# EAGLE design preliminary (EAGLE 8.6.0)
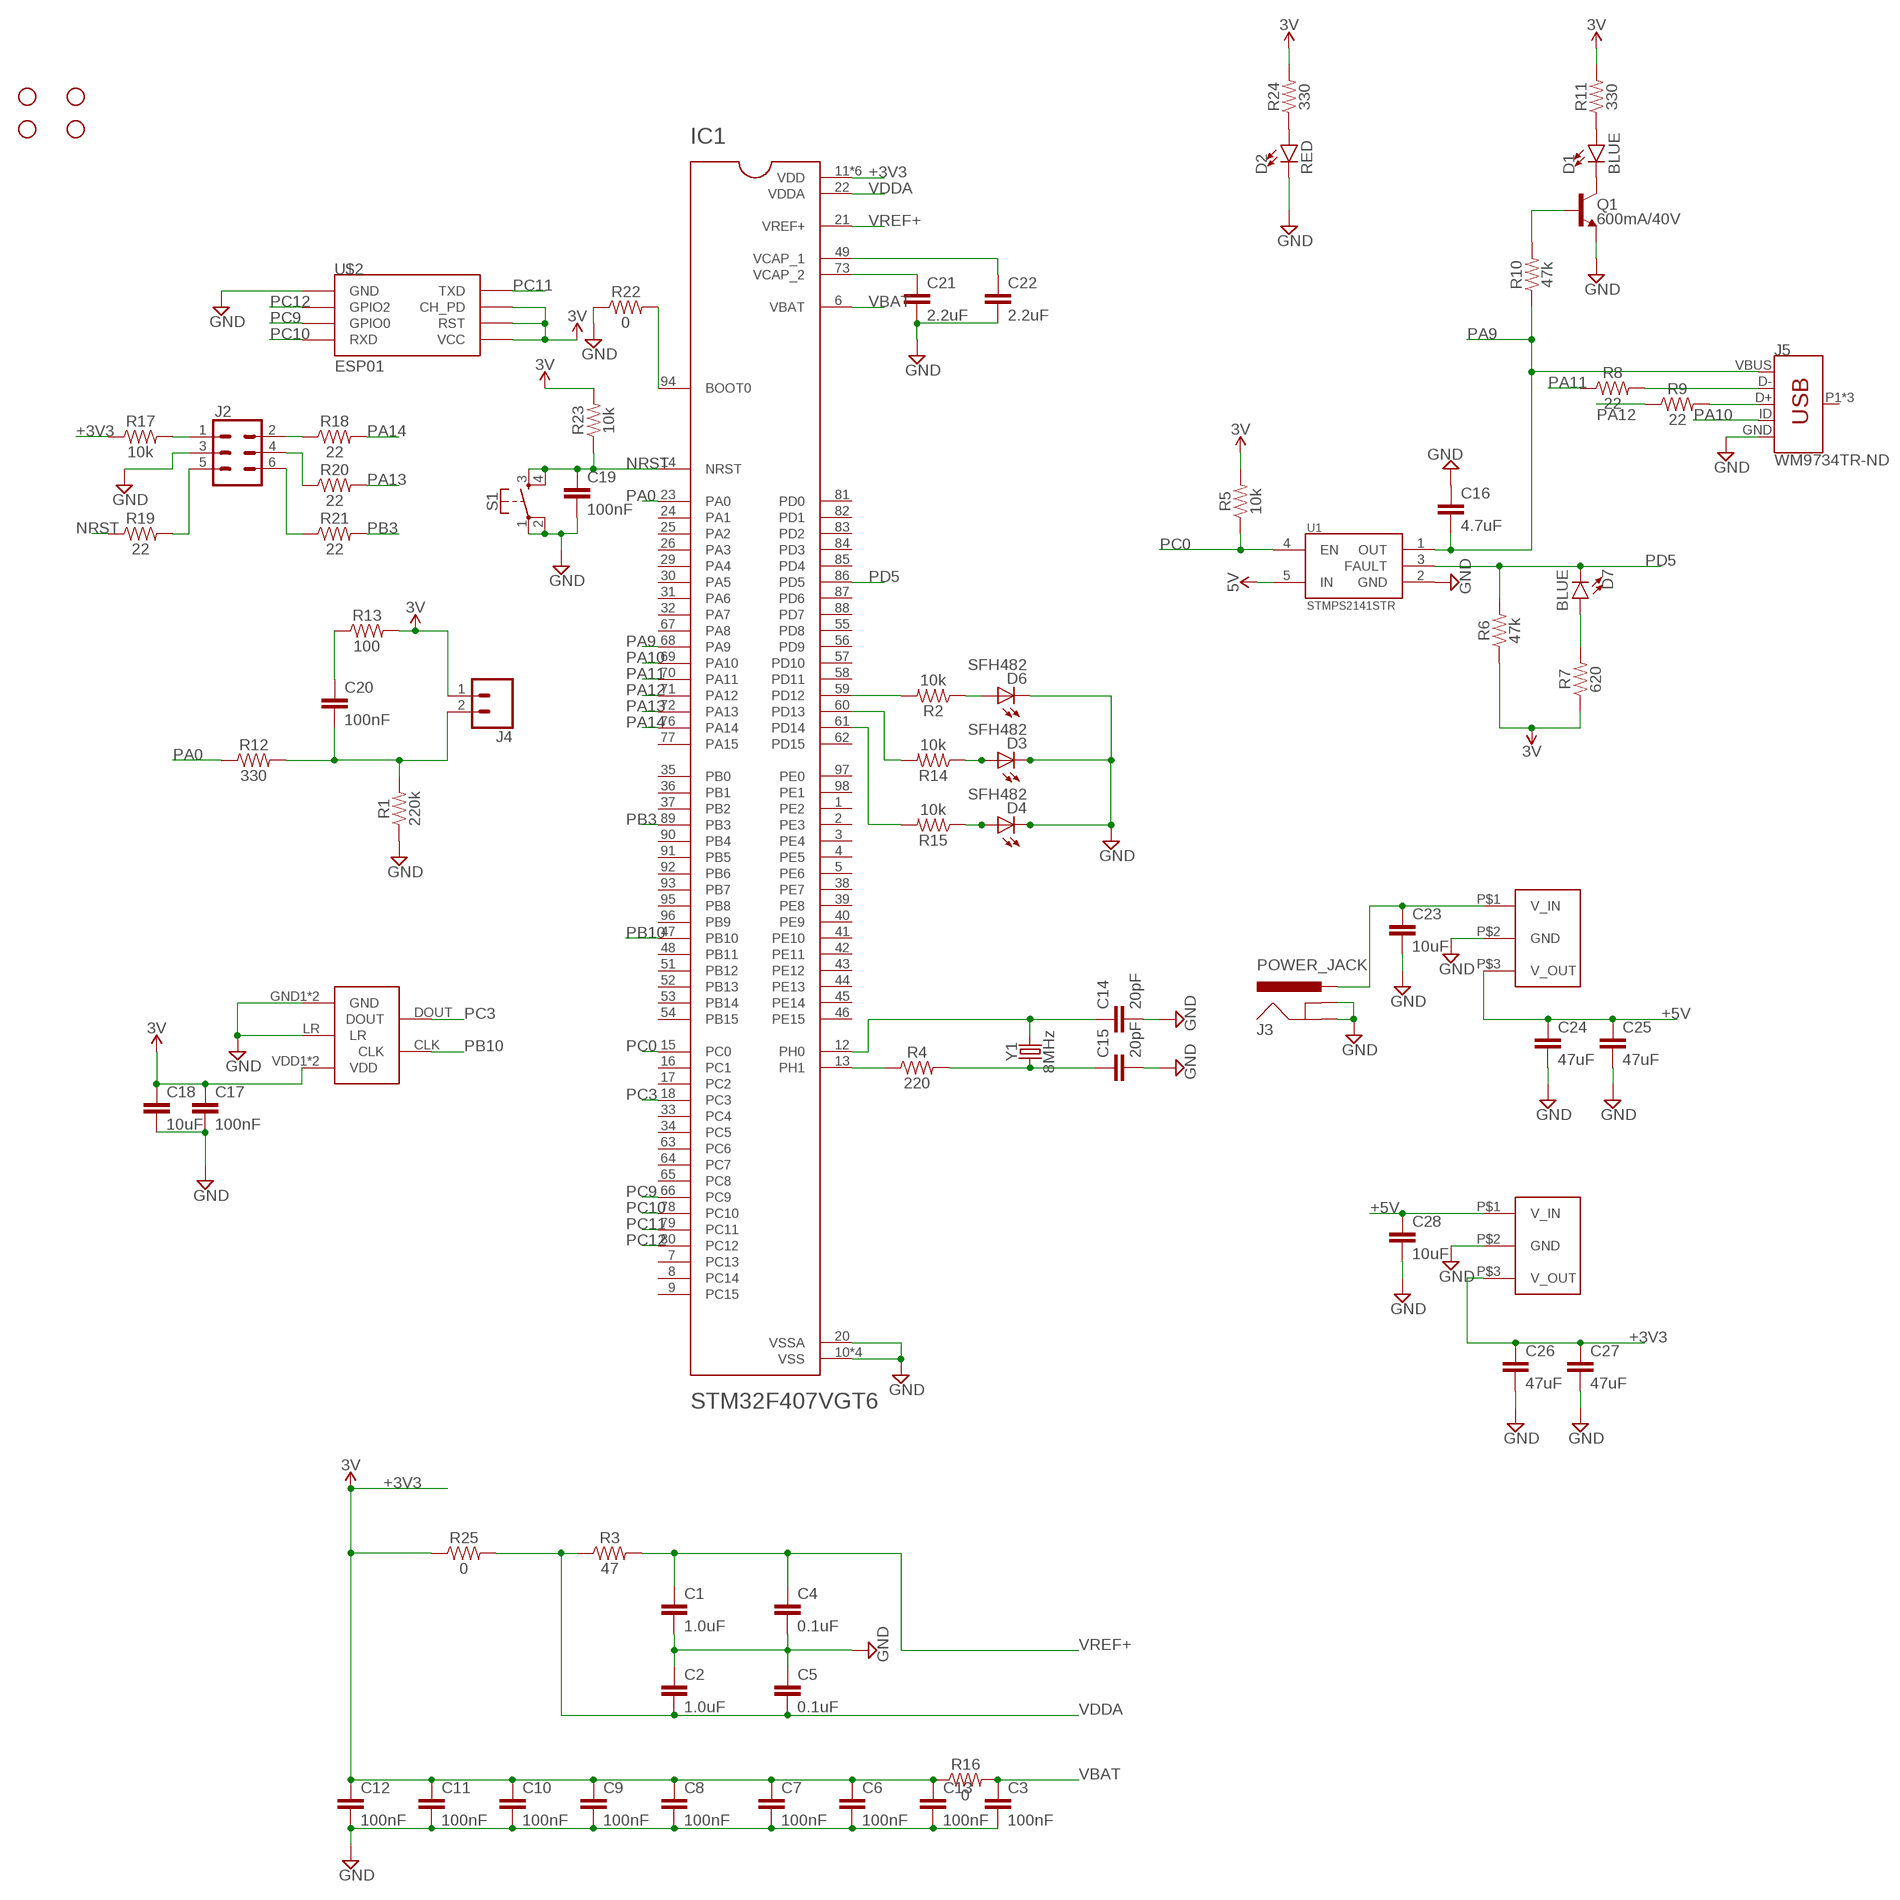
[diagram p0: schematic, sheet 1]

## Parts
C1  1.0uF  1.0UF-0603-16V-10%  [0603]
C2  1.0uF  1.0UF-0603-16V-10%  [0603]
C3  100nF  10NF-0603-50V-10%  [0603]
C4  0.1uF  0.1UF-0603-25V-(+80/-20%)  [0603]
C5  0.1uF  0.1UF-0603-25V-(+80/-20%)  [0603]
C6  100nF  10NF-0603-50V-10%  [0603]
C7  100nF  10NF-0603-50V-10%  [0603]
C8  100nF  10NF-0603-50V-10%  [0603]
C9  100nF  10NF-0603-50V-10%  [0603]
C10  100nF  10NF-0603-50V-10%  [0603]
C11  100nF  10NF-0603-50V-10%  [0603]
C12  100nF  10NF-0603-50V-10%  [0603]
C13  100nF  10NF-0603-50V-10%  [0603]
C14  20pF  22PF-0603-50V-5%  [0603]
C15  20pF  22PF-0603-50V-5%  [0603]
C16  4.7uF  4.7UF0603  [0603]
C17  100nF  10UF-0603-6.3V-20%  [0603]
C18  10uF  10UF-0603-6.3V-20%  [0603]
C19  100nF  3.0NF-0603-50V-5%  [0603]
C20  100nF  3.0NF-0603-50V-5%  [0603]
C21  2.2uF  4.7UF0603  [0603]
C22  2.2uF  4.7UF0603  [0603]
C23  10uF  10UF-0603-6.3V-20%  [0603]
C24  47uF  0.1UF-0603-25V-5%  [0603]
C25  47uF  0.1UF-0603-25V-5%  [0603]
C26  47uF  0.1UF-0603-25V-5%  [0603]
C27  47uF  0.1UF-0603-25V-5%  [0603]
C28  10uF  10UF-0603-6.3V-20%  [0603]
D1  BLUE  LED-BLUE0603  [LED-0603]
D2  RED  LED-BLUE0603  [LED-0603]
D3  SFH482  [SFH482]
D4  SFH482  [SFH482]
D6  SFH482  [SFH482]
D7  BLUE  LED-BLUE0603  [LED-0603]
H1  STAND-OFF  [STAND-OFF]
H2  STAND-OFF  [STAND-OFF]
H3  STAND-OFF  [STAND-OFF]
H4  STAND-OFF  [STAND-OFF]
IC1  STM32F407VGT6  [QFP50P1600X1600X160-100N]
J2  CONN_03X2FEMALE_SMD  [2X3_SMD]
J3  POWER_JACK  [POWER_JACK_PTH]
J4  CONN_02  [1X02]
J5  WM9734TR-ND  USB_MICRO-B_FEMALE-SMT-VERT  [USB-B-MICRO-SMD_VERT]
Q1  600mA/40V  TRANS_NPN-MMBT2222AL  [SOT23-3]
R1  220k  220KOHM-0603-1/10W-1%  [0603]
R2  10k  2.2KOHM-0603-1/10W-1%  [0603]
R3  47  47KOHM-0603-1/10W-1%  [0603]
R4  220  220KOHM-0603-1/10W-1%  [0603]
R5  10k  2.2KOHM-0603-1/10W-1%  [0603]
R6  47k  33KOHM-0603-1/10W-1%  [0603]
R7  620  220OHM-0603-1/10W-1%  [0603]
R8  22  22OHM-0603-1/10W-1%  [0603]
R9  22  22OHM-0603-1/10W-1%  [0603]
R10  47k  47KOHM-0603-1/10W-1%  [0603]
R11  330  330OHM-0603-1/10W-1%  [0603]
R12  330  220KOHM-0603-1/10W-1%  [0603]
R13  100  220KOHM-0603-1/10W-1%  [0603]
R14  10k  2.2KOHM-0603-1/10W-1%  [0603]
R15  10k  2.2KOHM-0603-1/10W-1%  [0603]
R16  0  220KOHM-0603-1/10W-1%  [0603]
R17  10k  220KOHM-0603-1/10W-1%  [0603]
R18  22  220KOHM-0603-1/10W-1%  [0603]
R19  22  220KOHM-0603-1/10W-1%  [0603]
R20  22  220KOHM-0603-1/10W-1%  [0603]
R21  22  220KOHM-0603-1/10W-1%  [0603]
R22  0  0.05OHM-0603-1/5W-1%  [0603]
R23  10k  220KOHM-0603-1/10W-1%  [0603]
R24  330  330OHM-0603-1/10W-1%  [0603]
R25  0  0OHM-0603-1/10W-5%  [0603]
S1  MOMENTARY-SWITCH-SPST-2-SMD-4.6X2.8MM  [TACTILE_SWITCH_SMD_4.6X2.8MM]
U1  STMPS2141STR  [SOT95P280X145-5N]
U$2  ESP01  [ESP01]
U$4  TPSM5  [TO-220]
U$5  TPSM3.3  [TO-220]
U$6  MP45DT02-M  [HLGA]
Y1  8MHz  CRYSTALPTH-HC49US  [HC49US]

## Nets
+3V3: C6.1 C7.1 C8.1 C9.1 C10.1 C11.1 C12.1 C13.1 C17.1 C18.1 C26.1 C27.1 IC1.11(VDD) IC1.19(VDD) IC1.28(VDD) IC1.50(VDD) IC1.75(VDD) IC1.100(VDD) J4.1 R5.2 R6.1 R7.1 R11.2 R13.2 R16.1 R17.1 R23.2 R24.2 R25.1 U$2.CH_PD U$2.RST U$2.VCC U$5.P$3(V_OUT) U$6.VDD1(VDD) U$6.VDD2(VDD) ; supply symbol labelled 3V
+5V: C24.1 C25.1 C28.1 U1.5(IN) U$4.P$3(V_OUT) U$5.P$1(V_IN) ; supply symbol labelled 5V
GND: C1.2 C2.1 C3.2 C4.2 C5.1 C6.2 C7.2 C8.2 C9.2 C10.2 C11.2 C12.2 C13.2 C14.2 C15.2 C16.1 C17.2 C18.2 C19.2 C21.2 C22.2 C23.2 C24.2 C25.2 C26.2 C27.2 C28.2 D2.C D3.K(C) D4.K(C) D6.K(C) IC1.10(VSS) IC1.20(VSSA) IC1.27(VSS) IC1.74(VSS) IC1.99(VSS) J2.3 J3.GND J3.GNDBREAK J5.GND Q1.2(E) R1.1 R22.1 S1.1 S1.2 U1.2(GND) U$2.GND U$4.P$2(GND) U$5.P$2(GND) U$6.GND1(GND) U$6.GND2(GND) U$6.LR
N$1: IC1.13(PH1) R4.1
N$2: C15.1 R4.2 Y1.1
N$3: C14.1 IC1.12(PH0) Y1.2
N$4: C20.2 J4.2 R1.2 R12.2
N$5: D7.A R7.2
N$6: J5.D- R8.2
N$7: J5.D+ R9.2
N$8: Q1.1(B) R10.2
N$9: D1.C Q1.3(C)
N$10: D1.A R11.1
N$11: D6.A R2.1
N$12: J2.2 R18.1
N$13: IC1.61(PD14) R15.2
N$14: IC1.60(PD13) R14.2
N$15: C20.1 R13.1
N$16: IC1.59(PD12) R2.2
N$17: D3.A R14.1
N$18: D4.A R15.1
N$19: C21.1 IC1.73(VCAP_2)
N$20: C22.1 IC1.49(VCAP_1)
N$21: J2.5 R19.2
N$22: J2.1 R17.2
N$23: C23.1 J3.PWR U$4.P$1(V_IN)
N$24: J2.4 R20.1
N$25: IC1.94(BOOT0) R22.2
N$26: J2.6 R21.1
N$28: D2.A R24.1
NRST: C19.1 IC1.14(NRST) R19.1 R23.1 S1.3 S1.4
PA0: IC1.23(PA0) R12.1
PA9: C16.2 IC1.68(PA9) J5.VBUS R10.1 U1.1(OUT)
PA10: IC1.69(PA10) J5.ID
PA11: IC1.70(PA11) R8.1
PA12: IC1.71(PA12) R9.1
PA13: IC1.72(PA13) R20.2
PA14: IC1.76(PA14) R18.2
PB3: IC1.89(PB3) R21.2
PB10: IC1.47(PB10) U$6.CLK
PC0: IC1.15(PC0) R5.1 U1.4(EN)
PC3: IC1.18(PC3) U$6.DOUT
PC9: IC1.66(PC9) U$2.GPIO0
PC10: IC1.78(PC10) U$2.RX(RXD)
PC11: IC1.79(PC11) U$2.TX(TXD)
PC12: IC1.80(PC12) U$2.GPIO2
PD5: D7.C IC1.86(PD5) R6.2 U1.3(FAULT)
VBAT: C3.1 IC1.6(VBAT) R16.2
VDDA: C2.2 C5.2 IC1.22(VDDA) R3.1 R25.2
VREF+: C1.1 C4.1 IC1.21(VREF+) R3.2
Unconnected: IC1.1(PE2) IC1.2(PE3) IC1.3(PE4) IC1.4(PE5) IC1.5(PE6) IC1.7(PC13) IC1.8(PC14) IC1.9(PC15) IC1.16(PC1) IC1.17(PC2) IC1.24(PA1) IC1.25(PA2) IC1.26(PA3) IC1.29(PA4) IC1.30(PA5) IC1.31(PA6) IC1.32(PA7) IC1.33(PC4) IC1.34(PC5) IC1.35(PB0) IC1.36(PB1) IC1.37(PB2) IC1.38(PE7) IC1.39(PE8) IC1.40(PE9) IC1.41(PE10) IC1.42(PE11) IC1.43(PE12) IC1.44(PE13) IC1.45(PE14) IC1.46(PE15) IC1.48(PB11) IC1.51(PB12) IC1.52(PB13) IC1.53(PB14) IC1.54(PB15) IC1.55(PD8) IC1.56(PD9) IC1.57(PD10) IC1.58(PD11) IC1.62(PD15) IC1.63(PC6) IC1.64(PC7) IC1.65(PC8) IC1.67(PA8) IC1.77(PA15) IC1.81(PD0) IC1.82(PD1) IC1.83(PD2) IC1.84(PD3) IC1.85(PD4) IC1.87(PD6) IC1.88(PD7) IC1.90(PB4) IC1.91(PB5) IC1.92(PB6) IC1.93(PB7) IC1.95(PB8) IC1.96(PB9) IC1.97(PE0) IC1.98(PE1) J5.P1(SHIELD) J5.P2(SHIELD) J5.P3(SHIELD)

## Library data of the parts
C1 C2 = SparkFun-Capacitors:1.0UF: 1µF ceramic capacitors A capacitor is a passive two-terminal electrical component used to store electrical energy temporarily in an electric field.; PROD_ID: CAP-00868
C3 C6-C13 = SparkFun-Capacitors:10NF: 0.01uF/10nF/10,000pF ceramic capacitors A capacitor is a passive two-terminal electrical component used to store electrical energy temporarily in an electric field. CAP-09321; PROD_ID: CAP-00867; VALUE: 10nF
C4 C5 = SparkFun-Capacitors:0.1UF: 0.1µF ceramic capacitors A capacitor is a passive two-terminal electrical component used to store electrical energy temporarily in an electric field.; PROD_ID: CAP-00810
C14 C15 = SparkFun-Capacitors:22PF: 22pF ceramic capacitors A capacitor is a passive two-terminal electrical component used to store electrical energy temporarily in an electric field.; PROD_ID: CAP-07876; VALUE: 22pF
C16 = SparkFun-Capacitors:4.7UF: 4.7µF ceramic capacitors A capacitor is a passive two-terminal electrical component used to store electrical energy temporarily in an electric field.; PROD_ID: CAP-08280
C17 = SparkFun-Capacitors:10UF: 10.0µF ceramic capacitors A capacitor is a passive two-terminal electrical component used to store electrical energy temporarily in an electric field.; PROD_ID: CAP-11015; VALUE: 10uF
C18 C23 C28 = SparkFun-Capacitors:10UF: 10.0µF ceramic capacitors A capacitor is a passive two-terminal electrical component used to store electrical energy temporarily in an electric field.; PROD_ID: CAP-11015
C19 C20 = SparkFun-Capacitors:3.0NF: 3.0nF (3nF, 3000pF) ceramic capacitors A capacitor is a passive two-terminal electrical component used to store electrical energy temporarily in an electric field.; PROD_ID: CAP-13515; VALUE: 3.0nF
C21 C22 = SparkFun-Capacitors:4.7UF: 4.7µF ceramic capacitors A capacitor is a passive two-terminal electrical component used to store electrical energy temporarily in an electric field.; PROD_ID: CAP-08280; VALUE: 4.7uF
C24-C27 = SparkFun-Capacitors:0.1UF: 0.1µF ceramic capacitors A capacitor is a passive two-terminal electrical component used to store electrical energy temporarily in an electric field.; PROD_ID: CAP-08604; VALUE: 0.1uF
D1 D7 = SparkFun-LED:LED-BLUE: Blue SMD LED Used in manufacturing of various products at SparkFun Packages: 0603 - SMD 0603 package [Product Link] <http://www.digikey.com/product-detail/en/SMLE12BC7TT86/511-1589-2-ND/1641808> 1206 - SMD1206 package [Product Link] <http://www.digikey.com/product-detail/en/lite-on-inc/LTST-C150TBKT/160-1643-1-ND/573584> SparkFun Products: ESP8266 Thing-Dev Board <https://www.sparkfun.com/products/13711> RedBoard <https://www.sparkfun.com/products/12757>; PROD_ID: DIO-08575
D2 = SparkFun-LED:LED-BLUE: Blue SMD LED Used in manufacturing of various products at SparkFun Packages: 0603 - SMD 0603 package [Product Link] <http://www.digikey.com/product-detail/en/SMLE12BC7TT86/511-1589-2-ND/1641808> 1206 - SMD1206 package [Product Link] <http://www.digikey.com/product-detail/en/lite-on-inc/LTST-C150TBKT/160-1643-1-ND/573584> SparkFun Products: ESP8266 Thing-Dev Board <https://www.sparkfun.com/products/13711> RedBoard <https://www.sparkfun.com/products/12757>; PROD_ID: DIO-08575; VALUE: BLUE
D3 D4 D6 = led:SFH482: IR LED infrared emitting diode, Infineon
H1-H4 = SparkFun-Hardware:STAND-OFF: Stand Off Drill holes for mechanically mounting via screws, standoffs, etc. Note: Use the keepout ring to avoid running the screw head into surrounding components. Variant Overviews STAND-OFF - Mechanical footprint for a #4 phillips button head screw. STAND-OFF-TIGHT - Mechanical footprint for a #4 phillips button head screw, Example SparkFun Products Screw - Phillips Head (1/4", 4-40, 10 pack) <https://www.sparkfun.com/products/10453> (PRT-10453) Screw - Phillips Head (1/2", 4-40, 10 pack) <https://www.sparkfun.com/products/10452> (PRT-10452) Screw - Phillips Head (3/4", 4-40, 10 pack) <https://www.sparkfun.com/products/10451> (PRT-10451) Screw - Phillips Head (1", 4-40, 10 pack) <https://www.sparkfun.com/products/10450> (PRT-10450)
IC1 = STM32F407VGT6:STM32F407VGT6: STM32 Series 32-bit 1 MB Flash 192 kB RAM ARM Based Microcontroller - LQFP-100; AVAILABILITY: Good; DESCRIPTION: IC MCU 32BIT 1MB FLASH 100LQFP; MF: STMicroelectronics; MP: STM32F407VGT6; PACKAGE: LQFP-100 STMicroelectronics; PRICE: 10.95 USD
J2 = SparkFun-Connectors:CONN_03X2: Multi connection point. Often used as Generic Header-pin footprint for 0.1 inch spaced/style header connections You can populate with any combo of single row headers, but if you'd like an exact match, check these: Header - 2x3 (Male, 0.1") <https://www.sparkfun.com/products/12807> (PRT-12807) Header - 2x3 (Female, 0.1") <https://www.sparkfun.com/products/13010> (PRT-13010) 2x3 Pin Shrouded Header <https://www.sparkfun.com/products/10877> (PRT-10877) On any of the 0.1 inch spaced packages, you can populate with these: Break Away Headers - Straight <https://www.sparkfun.com/products/116> (PRT-00116) Break Away Male Headers - Right Angle <https://www.sparkfun.com/products/553> (PRT-00553) Female Headers <https://www.sparkfun.com/products/115> (PRT-00115) Break Away Headers - Machine Pin <https://www.sparkfun.com/products/117> (PRT-00117) Break Away Female Headers - Swiss Machine Pin <https://www.sparkfun.com/products/743> (PRT-00743) Special note: the shrouded connector mates well with our 3x2 ribbon cables: Ribbon Crimp Connector - 6-pin (2x3, Female) <https://www.sparkfun.com/products/10651> (PRT-10651) Ribbon Cable - 6 wire (15ft) <https://www.sparkfun.com/products/10646> (PRT-10646); PROD_ID: CONN-11290
J3 = SparkFun-Connectors:POWER_JACK: Power Jack Connector This is the standard 5.5mm barrel jack for power. The PTH is the most common, proven, reliable, footprint. The Slot footprint only works if the mill layer is transmitted to the PCB fab house so be warned. Here are the connectors we sell at SparkFun: DC Barrel Power Jack/Connector <https://www.sparkfun.com/products/119> (PRT-00119) DC Barrel Power Jack/Connector (SMD) <https://www.sparkfun.com/products/12748> (PRT-12748) DC Barrel Jack Adapter - Breadboard Compatible <https://www.sparkfun.com/products/10811> (PRT-10811) It is used on this SparkFun product (and many, many others): SparkFun RedBoard - Programmed with Arduino <https://www.sparkfun.com/products/12757> (DEV-12757) Also, if you need a mating power supply or connector, please check these out: Wall Adapter Power Supply - 9VDC 650mA <https://www.sparkfun.com/products/298> (TOL-00298) DC Barrel Jack Adapter - Male <https://www.sparkfun.com/products/10287> (PRT-10287); PROD_ID: CONN-08197
J4 = SparkFun-Connectors:CONN_02: Multi connection point. Often used as Generic Header-pin footprint for 0.1 inch spaced/style header connections On any of the 0.1 inch spaced packages, you can populate with these: Break Away Headers - Straight <https://www.sparkfun.com/products/116> (PRT-00116) Break Away Male Headers - Right Angle <https://www.sparkfun.com/products/553> (PRT-00553) Female Headers <https://www.sparkfun.com/products/115> (PRT-00115) Break Away Headers - Machine Pin <https://www.sparkfun.com/products/117> (PRT-00117) Break Away Female Headers - Swiss Machine Pin <https://www.sparkfun.com/products/743> (PRT-00743) For SCREWTERMINALS and SPRING TERMINALS visit here: Screw Terimnals on SparkFun.com <https://www.sparkfun.com/search/results?term=Screw+Terminals> (5mm/3.5mm/2.54mm spacing) This device is also useful as a general connection point to wire up your design to another part of your project. Our various solder wires solder well into these plated through hole pads. Hook-Up Wire - Assortment (Stranded, 22 AWG) <https://www.sparkfun.com/products/11375> (PRT-11375) Hook-Up Wire - Assortment (Solid Core, 22 AWG) <https://www.sparkfun.com/products/11367> (PRT-11367) View the entire wire category on our website here <https://www.sparkfun.com/categories/141> Special notes: Molex polarized connector foot print use with: PRT-08233 with associated crimp pins and housings. 2.54_SCREWTERM for use with PRT-10571. 3.5mm Screw Terminal footprints for PRT-08084 5mm Screw Terminal footprints for use with PRT-08432
J5 = SparkFun-Connectors:USB_MICRO-B: USB Type Micro-B Connector Male/female and PTH/SMT variants SparkFun Products: SparkFun microB USB Breakout <https://www.sparkfun.com/products/12035> SparkFun USB microB Plug Breakout <https://www.sparkfun.com/products/10031> SparkFun ESP8266 Thing <https://www.sparkfun.com/products/13231>; PROD_ID: CONN-13534
Q1 = SparkFun-DiscreteSemi:TRANS_NPN: NPN transistor Current controlled devices typically used to amplify current or used as a switch. BC547 - COM-08928 <http://www.sparkfun.com/products/8928> (TO-92 45V 100mA) (1.Collector 2.Base 3.Emitter) 2N3904 - COM-00521 <http://www.sparkfun.com/products/521> (TO-92 40V 200mA) (1.Emitter 2.Base 3.Collector) P2N2222A - COM-12852 <http://www.sparkfun.com/products/12852> (TO-92 40V 600mA) (1.Collector 2.Base 3.Emitter); PROD_ID: TRANS-08049
R1 = SparkFun-Resistors:220KOHM: 220kΩ resistor A resistor is a passive two-terminal electrical component that implements electrical resistance as a circuit element. Resistors act to reduce current flow, and, at the same time, act to lower voltage levels within circuits. - Wikipedia; PROD_ID: RES-08969
R2 R5 R14 R15 = SparkFun-Resistors:2.2KOHM: 2.2kΩ resistor A resistor is a passive two-terminal electrical component that implements electrical resistance as a circuit element. Resistors act to reduce current flow, and, at the same time, act to lower voltage levels within circuits. - Wikipedia; PROD_ID: RES-08272; VALUE: 2.2k
R3 = SparkFun-Resistors:47KOHM: 47kΩ resistor A resistor is a passive two-terminal electrical component that implements electrical resistance as a circuit element. Resistors act to reduce current flow, and, at the same time, act to lower voltage levels within circuits. - Wikipedia; PROD_ID: RES-07871; VALUE: 47k
R4 R12 R13 R16-R21 R23 = SparkFun-Resistors:220KOHM: 220kΩ resistor A resistor is a passive two-terminal electrical component that implements electrical resistance as a circuit element. Resistors act to reduce current flow, and, at the same time, act to lower voltage levels within circuits. - Wikipedia; PROD_ID: RES-08969; VALUE: 220k
R6 = SparkFun-Resistors:33KOHM: 33kΩ resistor A resistor is a passive two-terminal electrical component that implements electrical resistance as a circuit element. Resistors act to reduce current flow, and, at the same time, act to lower voltage levels within circuits. - Wikipedia; PROD_ID: RES-08416; VALUE: 33k
R7 = SparkFun-Resistors:220OHM: 220Ω resistor A resistor is a passive two-terminal electrical component that implements electrical resistance as a circuit element. Resistors act to reduce current flow, and, at the same time, act to lower voltage levels within circuits. - Wikipedia; PROD_ID: RES-07861; VALUE: 220
R8 R9 = SparkFun-Resistors:22OHM: 22Ω resistor A resistor is a passive two-terminal electrical component that implements electrical resistance as a circuit element. Resistors act to reduce current flow, and, at the same time, act to lower voltage levels within circuits. - Wikipedia; PROD_ID: RES-08698
R10 = SparkFun-Resistors:47KOHM: 47kΩ resistor A resistor is a passive two-terminal electrical component that implements electrical resistance as a circuit element. Resistors act to reduce current flow, and, at the same time, act to lower voltage levels within circuits. - Wikipedia; PROD_ID: RES-07871
R11 R24 = SparkFun-Resistors:330OHM: 330Ω resistor A resistor is a passive two-terminal electrical component that implements electrical resistance as a circuit element. Resistors act to reduce current flow, and, at the same time, act to lower voltage levels within circuits. - Wikipedia; PROD_ID: RES-00818
R22 = SparkFun-Resistors:0.05OHM: 0.05Ω resistor A resistor is a passive two-terminal electrical component that implements electrical resistance as a circuit element. Resistors act to reduce current flow, and, at the same time, act to lower voltage levels within circuits. - Wikipedia; PROD_ID: RES-12535; VALUE: 0.05
R25 = SparkFun-Resistors:0OHM: 0Ω resistor A resistor is a passive two-terminal electrical component that implements electrical resistance as a circuit element. Resistors act to reduce current flow, and, at the same time, act to lower voltage levels within circuits. - Wikipedia; PROD_ID: RES-08609
S1 = SparkFun-Switches:MOMENTARY-SWITCH-SPST-2: Momentary Switch (Pushbutton) - SPST - Two Circuits Normally-open (NO) SPST momentary switches (buttons, pushbuttons). Schematic symbol includes two switch circuits. Variants SMD-4.6MMX2.8MM - 4.60mm x 2.80mm Tactile Momentary Button Switch - Used on SparkFun SAMD21 Mini Breakout <https://www.sparkfun.com/products/13664> SMD-5.2MM - Mini Pushbutton Switch - SMD <https://www.sparkfun.com/products/8720> - Used on Arduino Pro Mini <https://www.sparkfun.com/products/11114>; PROD_ID: SWCH-13065
U1 = STMPS2141STR:STMPS2141STR: ST Series 5.5 V 0.5 A Single Channel Active Low Enhanced Power Switch - SOT23-5L; AVAILABILITY: Good; DESCRIPTION: IC PWR SWITCH 1CH 500MA SOT23-5; MF: STMicroelectronics; MP: STMPS2141STR; PACKAGE: SOT-23 STMicroelectronics; PRICE: 0.29 USD
U$2 = esp8266modules:ESP01: ESP8266 Wifi module 01
U$4 = preliminary:TPSM5
U$5 = preliminary:TPSM3.3
U$6 = preliminary:MP45DT02-M
Y1 = SparkFun-Clocks:CRYSTAL: Crystals (Generic) These are passive quartz crystals, which can be used as a clock source for a microcontroller. Crystal's are two-terminal devices. They require external "load" capacitors to generate an oscillating signal.

## Board
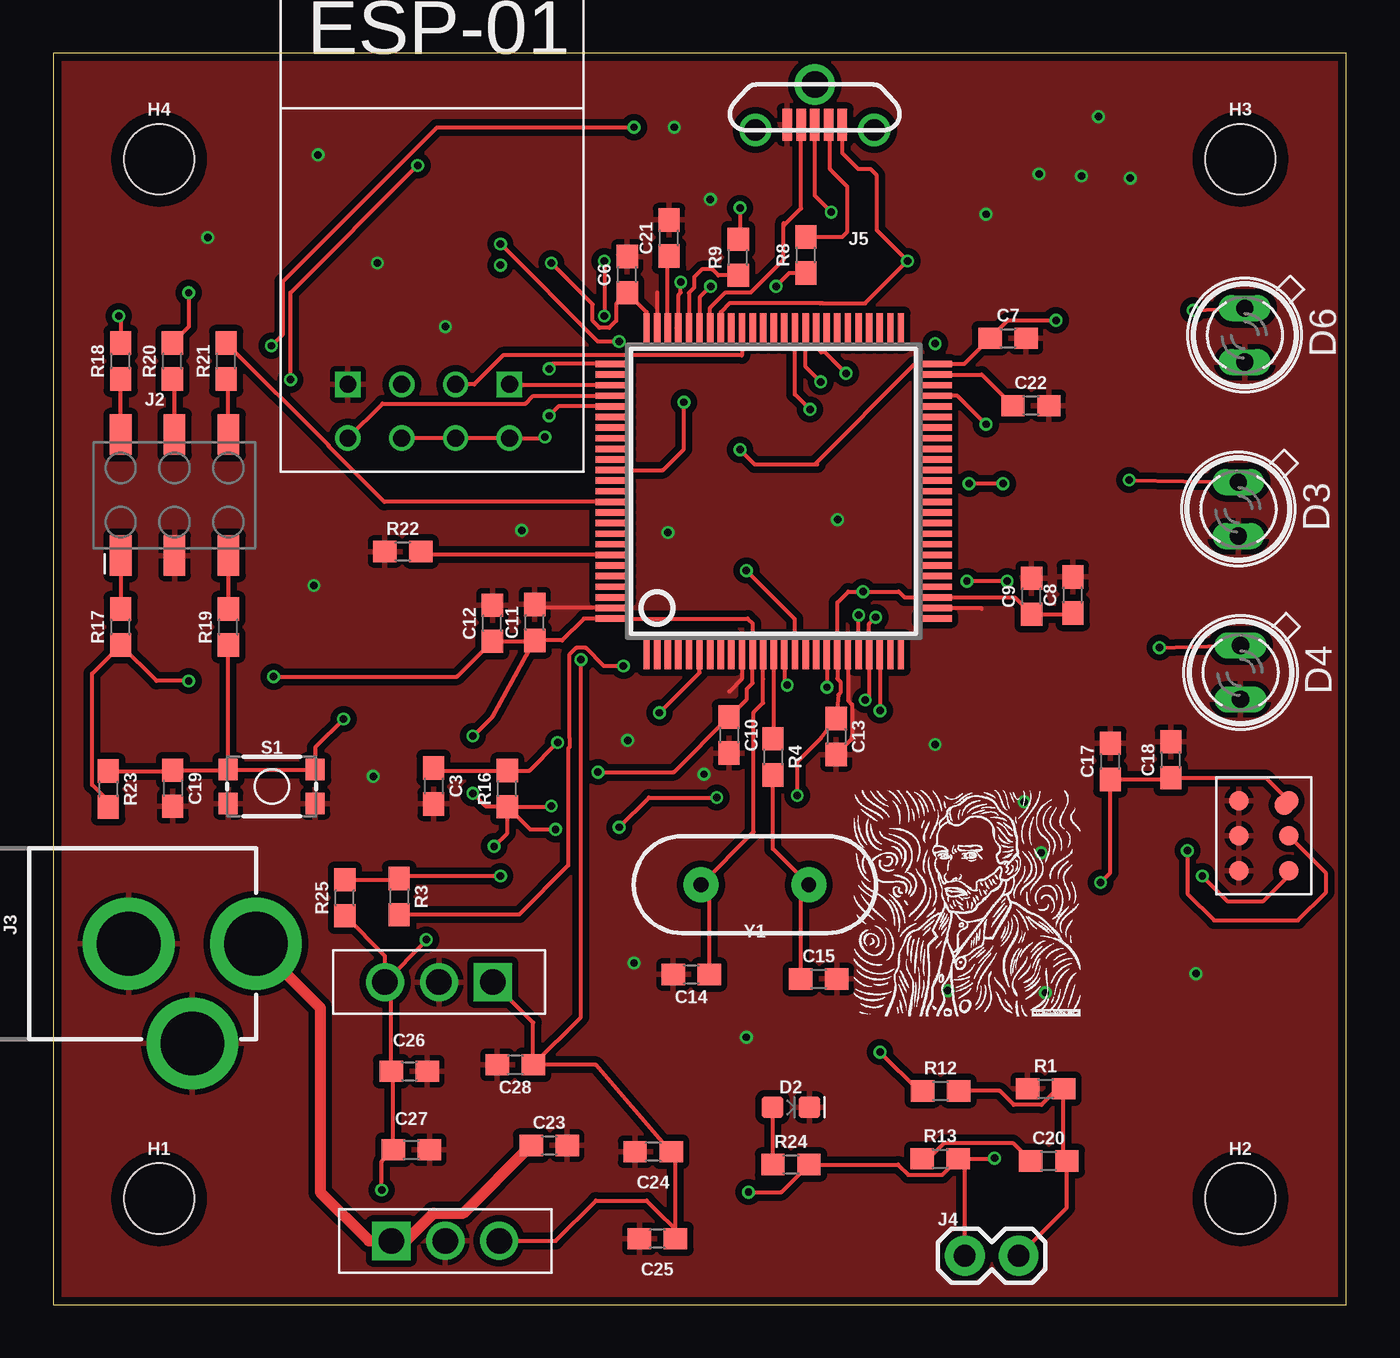
[diagram p1: board, top side]
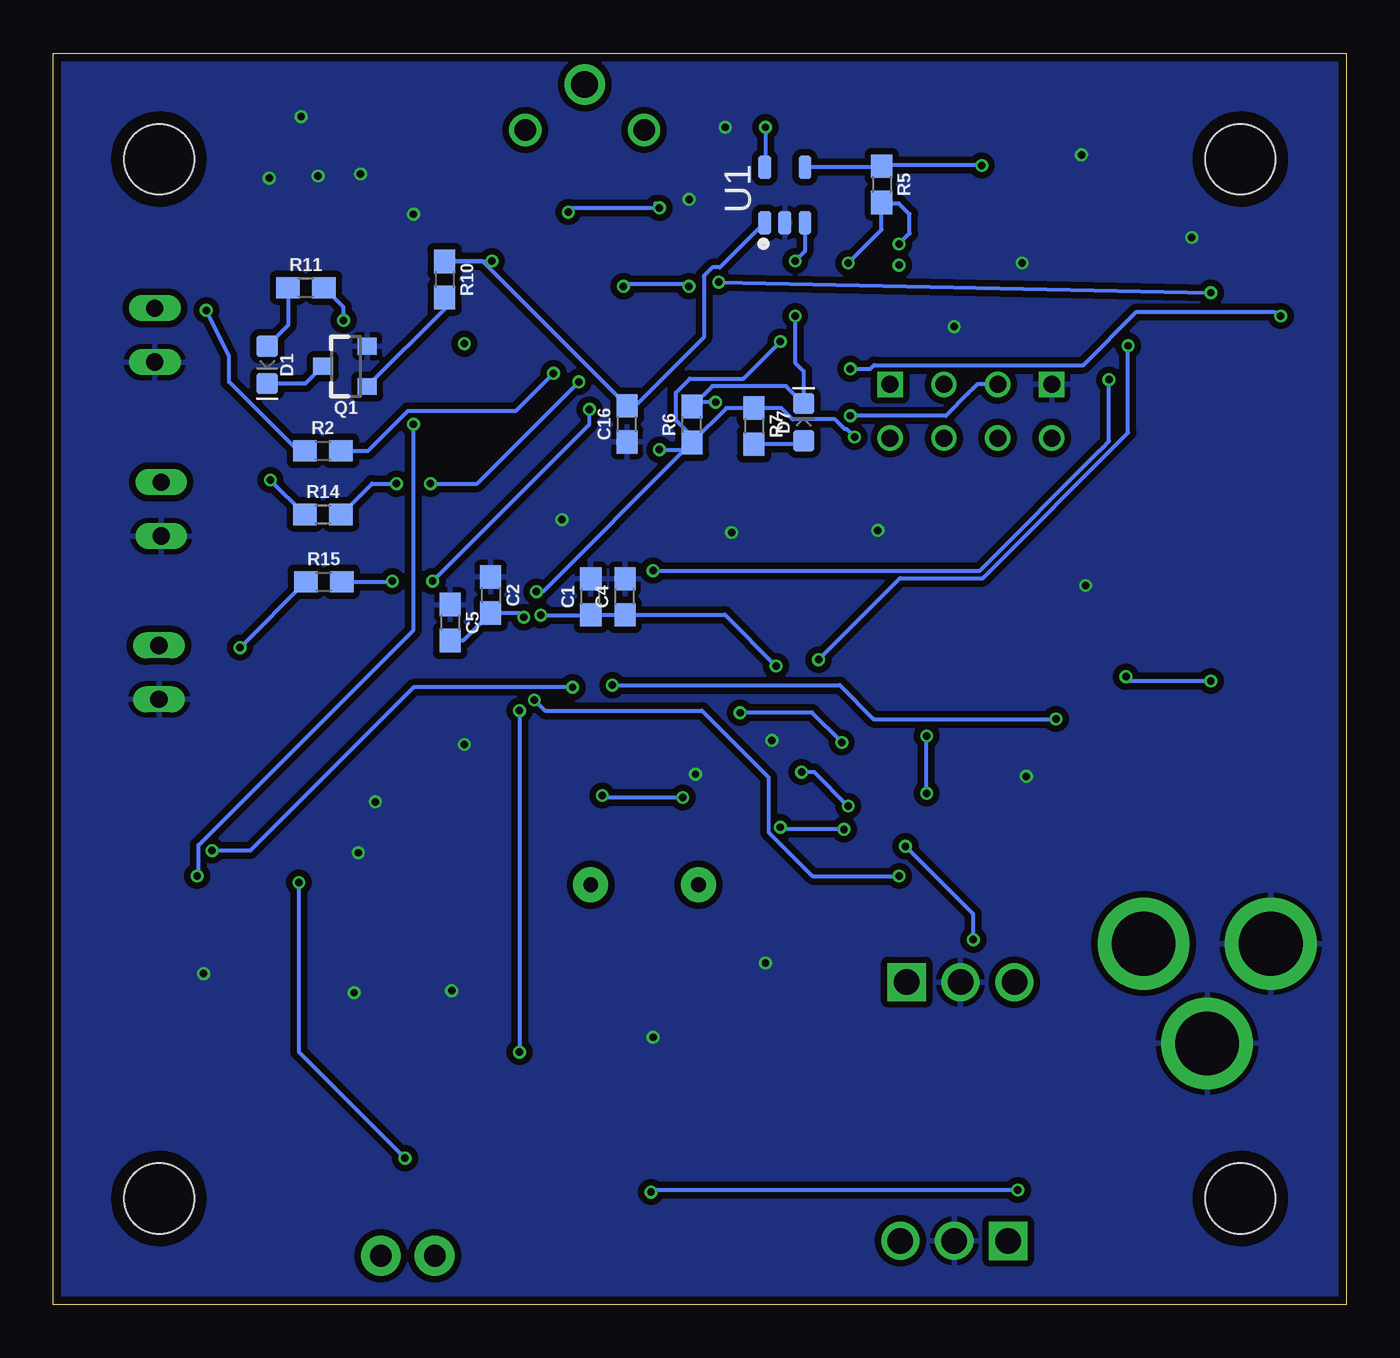
[diagram p2: board, bottom side, seen from below]

Size 61 x 59 mm. Coordinates in mm from the lower left corner, seen from the top.
Outline: 0,0 61,0 61,59 0,59 0,0
Copper layers (1*16): Top 0.035559375mm / dielectric 1.6mm / Bottom 0.035559375mm
Design rules "oshpark-2layer": minimum track width 6mil, minimum drill 10mil, track to track 6mil, track to pad 6mil, pad to pad 6mil, via to via 6mil, smd to smd 6mil, copper to edge 15mil, drill to drill 6mil, minimum pad ring 5mil, minimum via ring 5mil, stop-mask expansion 2.5mil, vias tented up to drill 0mil, thermal gap 10mil

### Footprints (pad centres in the part's own frame; a part is rotated, then mirrored left to right if it is on the bottom)
0603 = smd 1.1 x 1: 1 -0.85,0; 2 0.85,0
LED-0603 = smd 1 x 1: A -0.877,0; C 0.877,0
SFH482 = drill 0.813 long: A -1.27,0; K 1.27,0
STAND-OFF = hole 3.302: 0,0
QFP50P1600X1600X160-100N = smd 0.3 x 1.6: 1 -6,-7.6; 2 -5.5,-7.6; 3 -5,-7.6; 4 -4.5,-7.6; 5 -4,-7.6; 6 -3.5,-7.6; 7 -3,-7.6; 8 -2.5,-7.6; 9 -2,-7.6; 10 -1.5,-7.6; 11 -1,-7.6; 12 -0.5,-7.6; 13 0,-7.6; 14 0.5,-7.6; 15 1,-7.6; 16 1.5,-7.6; 17 2,-7.6; 18 2.5,-7.6; 19 3,-7.6; 20 3.5,-7.6; 21 4,-7.6; 22 4.5,-7.6; 23 5,-7.6; 24 5.5,-7.6; 25 6,-7.6; 51 6,7.6; 52 5.5,7.6; 53 5,7.6; 54 4.5,7.6; 55 4,7.6; 56 3.5,7.6; 57 3,7.6; 58 2.5,7.6; 59 2,7.6; 60 1.5,7.6; 61 1,7.6; 62 0.5,7.6; 63 0,7.6; 64 -0.5,7.6; 65 -1,7.6; 66 -1.5,7.6; 67 -2,7.6; 68 -2.5,7.6; 69 -3,7.6; 70 -3.5,7.6; 71 -4,7.6; 72 -4.5,7.6; 73 -5,7.6; 74 -5.5,7.6; 75 -6,7.6 | smd 1.6 x 0.3: 26 7.6,-6; 27 7.6,-5.5; 28 7.6,-5; 29 7.6,-4.5; 30 7.6,-4; 31 7.6,-3.5; 32 7.6,-3; 33 7.6,-2.5; 34 7.6,-2; 35 7.6,-1.5; 36 7.6,-1; 37 7.6,-0.5; 38 7.6,0; 39 7.6,0.5; 40 7.6,1; 41 7.6,1.5; 42 7.6,2; 43 7.6,2.5; 44 7.6,3; 45 7.6,3.5; 46 7.6,4; 47 7.6,4.5; 48 7.6,5; 49 7.6,5.5; 50 7.6,6; 76 -7.6,6; 77 -7.6,5.5; 78 -7.6,5; 79 -7.6,4.5; 80 -7.6,4; 81 -7.6,3.5; 82 -7.6,3; 83 -7.6,2.5; 84 -7.6,2; 85 -7.6,1.5; 86 -7.6,1; 87 -7.6,0.5; 88 -7.6,0; 89 -7.6,-0.5; 90 -7.6,-1; 91 -7.6,-1.5; 92 -7.6,-2; 93 -7.6,-2.5; 94 -7.6,-3; 95 -7.6,-3.5; 96 -7.6,-4; 97 -7.6,-4.5; 98 -7.6,-5; 99 -7.6,-5.5; 100 -7.6,-6
2X3_SMD = smd 1.02 x 1.9: 1 -2.54,-2.85; 2 -2.54,2.85; 3 0,-2.85; 4 0,2.85; 5 2.54,-2.85; 6 2.54,2.85
POWER_JACK_PTH = drill 2.997 pad 4.318: GND 0,7.7; GNDBREAK 4.7,10.7; PWR 0,13.7
1X02 = drill 1.016 pad 1.88: 1 0,0; 2 2.54,0
USB-B-MICRO-SMD_VERT = smd 0.45 x 1.5: D+ 0,0; D- -0.65,0; GND 1.3,0; ID 0.65,0; VBUS -1.3,0 | drill 1.016: P1 -2.8,0.25; P2 2.8,0.25 | drill 1.27: P3 0,-1.9
SOT23-3 = smd 0.8 x 0.9: 1 -0.95,-1; 2 0.95,-1; 3 0,1.1
TACTILE_SWITCH_SMD_4.6X2.8MM = smd 0.9 x 1: 1 -2.05,-0.8; 2 2.05,-0.8; 3 2.05,0.8; 4 -2.05,0.8
SOT95P280X145-5N = smd 1.1 x 0.6: 1 -1.3,0.95; 2 -1.3,0; 3 -1.3,-0.95; 4 1.3,-0.95; 5 1.3,0.95
ESP01 = drill 0.8: CH_PD -1.285,-8.178; GPIO0 1.255,-5.638; GPIO2 -1.285,-5.638; RST 1.255,-8.178; TX -3.825,-8.178; VCC 3.795,-8.178 | drill 0.8 square: GND -3.825,-5.638; RX 3.795,-5.638
TO-220 = drill 1.2 square: P$1 -2.54,0 | drill 1.2: P$2 0,0; P$3 2.54,0
HLGA = smd 0.91 x 0.91: CLK 1.17,-1.65; DOUT 1.17,0; GND1 -1.17,1.65; GND2 -1.17,-1.65; LR -1.17,0; VDD1 1.17,1.65; VDD2 0.97,1.45
HC49US = drill 0.7 pad 1.651: 1 -2.54,0; 2 2.54,0

### Placement (x,y rotation side)
C1  35.64,33.37 90 bottom
C2  40.36,33.45 270 bottom
C3  17.95,24.45 270 top
C4  34.03,33.37 90 bottom
C5  42.27,32.15 270 bottom
C6  27.08,48.55 90 top
C7  45.04,45.55 0 top
C8  48.1,33.45 90 top
C9  46.15,33.39 90 top
C10  31.88,26.85 270 top
C11  22.72,32.16 90 top
C12  20.72,32.12 90 top
C13  36.93,26.78 270 top
C14  30.1,15.56 180 top
C15  36.12,15.35 0 top
C16  33.93,41.52 90 bottom
C17  49.86,25.61 90 top
C18  52.72,25.68 90 top
C19  5.65,24.34 270 top
C20  46.96,6.77 0 top
C21  29.05,50.28 90 top
C22  46.12,42.38 0 top
C23  23.4,7.5 0 top
C24  28.3,7.2 180 top
C25  28.5,3.1 180 top
C26  16.8,11 0 top
C27  16.9,7.3 0 top
C28  21.8,11.3 180 top
D1  50.9,44.3 270 bottom
D2  34.8,9.3 0 top
D3  55.9,37.5 270 top
D4  56,29.8 270 top
D6  56.2,45.7 270 top
D7  25.6,41.6 90 bottom
H1  5,5 0 top
H2  56,5 0 top
H3  56,54 0 top
H4  5,54 0 top
IC1  33.99,38.34 0 top
J2  5.73,38.16 0 top
J3  -4.13,17.01 270 top
J4  43,2.3 0 top
J5  35.92,55.62 180 top
Q1  47.18,44.23 90 bottom
R1  46.81,10.17 0 top
R2  48.27,40.25 0 bottom
R3  16.32,19.23 270 top
R4  33.95,25.82 270 top
R5  21.92,52.81 270 bottom
R6  30.87,41.49 90 bottom
R7  27.94,41.41 270 bottom
R8  35.51,49.48 90 top
R9  32.31,49.37 90 top
R10  42.53,48.33 270 bottom
R11  49.07,47.94 0 bottom
R12  41.86,10.07 0 top
R13  41.84,6.87 0 top
R14  48.27,37.24 0 bottom
R15  48.23,34.07 0 bottom
R16  21.43,24.32 90 top
R17  3.19,31.94 90 top
R18  3.19,44.48 90 top
R19  8.27,31.94 90 top
R20  5.63,44.48 90 top
R21  8.17,44.48 90 top
R22  16.5,35.5 0 top
R23  2.6,24.3 270 top
R24  34.8,6.6 0 top
R25  13.77,19.18 90 top
S1  10.32,24.42 0 top
U1  26.49,52.31 90 bottom
U$2  17.73,49.02 0 top
U$4  18.5,3 0 top
U$5  18.2,15.2 180 top
U$6  57.1,22.1 0 top
Y1  33.1,19.8 180 top

### Tracks (layer width: path | path; a pad name or v marks a point on that pad's centre or on a via)
+3V3  (via drill 0.35)
  Top 0.2: 15.66,15.28 U$5.P$3 | 15.5,10.9 15.83,10.97 | 15.83,10.97 C26.1 15.95,14.91 U$5.P$3 | J4.1 43,6.56 R13.2 | 58.22,23.7 U$6.VDD2 U$6.VDD1 | 58.22,23.7 U$6.VDD1 | R13.2 44.37,6.87 v44.4,6.9 | U$5.P$3 17.6,17.14 v17.6,17.2 | v20.8,21.6 21.43,22.23 R16.1 | R16.1 23.47,23.47 v23.5,23.5 | R16.1 20.43,23.47 v19.8,24.1 | v19.8,26.8 20.72,27.72 C11.1 | C11.1 22.48,31.07 | 10.47,29.67 v10.4,29.6 19.05,29.6 C12.1 22.68,31.27 C11.1 | v6.4,29.4 4.88,29.4 R17.1 1.85,29.75 1.85,24.49 2.6,23.74 R23.2 | U$2.CH_PD U$2.RST U$2.VCC 23.14,40.84 v23.2,40.9 | v32.4,40.3 33.1,39.6 35.9,39.6 | 36.04,39.6 35.9,39.6 | R16.1 22.5,22.4 v23.7,22.4 | v26.7,22.5 28.1,23.9 v31.3,23.9 | v35.1,24 35.1,25.6 36.23,26.73 C13.1 37.03,28.74 37.13,28.84 37.13,29.36 36.99,29.5 IC1.19 36.99,33.09 37.51,33.61 v38.2,33.61 39.89,33.61 40.16,33.34 IC1.28 45.35,33.34 C9.1 48.04,32.54 C8.1 | R13.2 41.94,6.12 40.34,6.12 39.85,6.6 R24.2 34.35,5.3 v32.8,5.3 | C11.1 24.01,31.31 25.04,32.34 IC1.100 32.76,32.34 32.99,32.11 IC1.11 32.99,29.3 32.72,29.03 32.72,28.54 C10.1 29.28,25.1 v25.7,25.1 | 35.9,39.6 40.6,44.3 41,44.3 41.04,44.34 IC1.50 42.98,44.34 C7.1 45.04,46.4 v47.3,46.4 | IC1.75 27.99,46.79 C6.1 26.55,47.17 26.55,46.37 26.23,46.05 25.77,46.05 25.45,46.37 25.45,47.15 v23.5,49.1 | v26.7,45.4 25.7,45.4 v21.1,50 | v15.5,5.4 15.5,6.75 C27.1 16.05,10.75 15.83,10.97 | 58.22,23.74 58.22,23.7 | v49.4,19.9 49.86,20.36 C17.1 52.65,24.76 C18.1 57.19,24.83 U$6.VDD1 | U$5.P$3 15.66,16.43 R25.1
  Bottom 0.2: v44.4,6.9 49.4,11.9 v49.4,19.9 | v17.6,17.2 17.6,18.4 v20.8,21.6 | v23.5,23.5 25.1,25.1 v25.7,25.1 | v19.8,24.1 v19.8,26.8 | v10.4,29.6 10.2,29.4 v6.4,29.4 | 31.21,40.3 37.9,33.61 v38.2,33.61 | v23.2,40.9 23.57,41.27 23.66,41.27 24.12,41.73 26.12,41.73 26.65,42.26 R7.1 29.25,42.26 R6.1 | v32.4,40.3 31.21,40.3 | 31.21,40.3 R6.1 | v47.3,46.4 47.3,47.02 R11.2 | v23.7,22.4 26.6,22.4 v26.7,22.5 | v31.3,23.9 35,23.9 v35.1,24 | v15.5,5.4 32.7,5.4 v32.8,5.3 | v23.5,49.1 21.92,50.68 21.92,51.9 | 21.92,51.9 R5.2 | v26.7,45.4 28.45,43.65 30.97,43.65 31.62,42.99 31.62,41.69 30.87,40.93 R6.1 | v21.1,50 20.6,50.5 20.6,51.4 21.1,51.9 21.92,51.9
+5V  (via drill 0.35)
  Top 0.2: U$4.P$3 23.7,3 25.6,4.9 28,4.9 29.8,3.1 C25.1 29.35,7.02 29.04,7.33 | C24.1 29.04,7.33 | 29.04,7.33 25.6,11.3 C28.1 | C28.1 24.9,13.55 v24.9,30.4 | v10.3,45.2 10.85,45.75 10.85,48.24 18.11,55.5 v27.4,55.5 | C28.1 22.65,13.29 U$5.P$1
  Bottom 0.2: v24.9,30.4 21.05,34.25 17.15,34.25 10.3,41.1 v10.3,45.2 | v27.4,55.5 27.4,53.65 U1.5
GND  (via drill 0.35)
  Top 0.2: IC1.10 32.49,29.49 31.9,28.9 | IC1.27 43.76,32.84 43.8,32.8 | IC1.74 28.5,47.7 | IC1.99 22.89,32.84 C11.2 | IC1.20 37.49,28.48 37.68,28.28 37.68,26.68 C13.2
  other vias: 46.5,53.3 41.6,26.4 30.7,25 27.1,26.6 7.3,50.3 12.5,54.2 15.3,49.1 18.5,46.1 29.3,55.5 31,52.1 44,51.4 48.5,53.2 50.8,53.1 49.3,56 37,37 29,36.4 45.8,23.7 46.8,14.7 42.2,14.8 53.9,15.6 46.6,21.3 32.7,12.6 27.4,16.1 15.1,24.9 12.3,33.9 22.1,36.5
  pour Top (isolate 0.305): 0,59 0,0 61,0 61,59
  pour Bottom (isolate 0.305): 0,0 61,0 61,59 0,59
GND10  (via drill 0.35)
  other vias: 21.1,49
GND24  (via drill 0.35)
  other vias: 41.6,45.3
N$1
  Top 0.2: R4.1 33.99,26.67 IC1.13
N$2
  Top 0.2: C15.1 35.27,19.42 Y1.1 33.95,21.49 R4.2
N$3
  Top 0.2: IC1.12 33.49,29.96 33.49,29.49 33.49,28.37 33.04,27.92 33.04,22.28 Y1.2 30.95,19.41 C14.1
N$4
  Top 0.2: J4.2 47.81,4.57 C20.2 47.66,6.92 R1.2 47.37,10.17 46.62,9.42 45.3,9.42 44.65,10.07 R12.2
N$5
  Bottom 0.2: D7.A 25.76,40.56 R7.2
N$6
  Top 0.2: R8.2 37.22,50.33 37.46,50.57 37.46,52.7 36.64,53.52 36.64,55.55 J5.D-
N$7  (via drill 0.35)
  Top 0.2: v32.4,51.7 32.4,50.31 R9.2 | v36.7,51.5 35.92,52.28 J5.D+
  Bottom 0.2: 32.6,51.9 v32.4,51.7 36.5,51.7 v36.7,51.5
N$8
  Bottom 0.2: R10.2 42.53,46.93 Q1.1
N$9
  Bottom 0.2: D1.C 49.09,43.42 Q1.3
N$10
  Bottom 0.2: R11.1 49.92,46.16 D1.A
N$11  (via drill 0.35)
  Top 0.2: v53.77,46.87 D6.A
  Bottom 0.2: R2.1 49.45,40.25 52.7,43.5 52.7,44.7 v53.77,46.87
N$12
  Top 0.2: J2.2 R18.1
N$13  (via drill 0.35)
  Top 0.2: v45,34.1 v43.1,34.1 | v35.7,42.2 34.99,42.91 IC1.61
  Bottom 0.2: R15.2 45.03,34.07 v45,34.1 | v43.1,34.1 35.7,41.5 v35.7,42.2
N$14  (via drill 0.35)
  Top 0.2: v44.8,38.7 v43.2,38.7 | v36.2,43.5 35.49,44.21 IC1.60
  Bottom 0.2: R14.2 45.96,38.7 v44.8,38.7 | v43.2,38.7 41,38.7 v36.2,43.5
N$15
  Top 0.2: R13.1 41.28,6.87 42.03,7.62 45.26,7.62 C20.1
N$16  (via drill 0.35)
  Top 0.2: v37.4,43.9 36.41,44.89 36.23,44.89 35.99,45.13 IC1.59
  Bottom 0.2: R2.2 46.14,40.25 44.26,42.13 39.17,42.13 v37.4,43.9
N$17  (via drill 0.35)
  Top 0.2: v50.75,38.87 D3.A
  Bottom 0.2: R14.1 v50.75,38.87
N$18  (via drill 0.35)
  Top 0.2: v52.18,30.97 D4.A
  Bottom 0.2: R15.1 v52.18,30.97
N$19
  Top 0.2: 28.95,46.19 29.04,46.18 29.04,45.99 IC1.73 28.99,49.37 arc-90 C21.1
N$20
  Top 0.2: IC1.49 43.81,43.84 C22.1
N$21
  Top 0.2: J2.5 R19.2
N$22
  Top 0.2: J2.1 R17.2
N$23
  Top 0.508: J3.PWR 12.6,13.98 12.6,5.3 14.9,3 U$4.P$1 16.65,3 17.96,4.31 19.36,4.31 C23.1
N$24
  Top 0.2: J2.4 5.73,43.53 R20.1
N$25
  Top 0.2: IC1.94 17.51,35.34 R22.2
N$26
  Top 0.2: J2.6 8.27,43.53 R21.1
N$28
  Top 0.2: D2.A 33.92,6.63 R24.1
NRST  (via drill 0.35)
  Top 0.2: S1.4 R19.1 | S1.4 8.24,25.19 C19.1 5.61,25.15 R23.1 | S1.4 S1.3 12.37,26.27 v13.7,27.6 | IC1.14 34.49,29.33 v34.62,29.2
  Bottom 0.2: v34.62,29.2 23.9,29.2 22.3,27.6 v13.7,27.6
PA0  (via drill 0.35)
  Top 0.2: IC1.23 v38.99,28.01 v39,28 | v39,11.9 40.83,10.07 R12.1
  Bottom 0.2: v39,28 v39,11.9
PA9  (via drill 0.35)
  Top 0.2: IC1.68 31.49,46.79 31.9,47.2 36.19,47.2 36.3,47.2 38.3,47.2 v40.3,49.2 38.85,50.65 38.85,53.24 38.57,53.52 37.98,53.52 37.23,54.28 J5.VBUS
  Bottom 0.2: U1.1 29.55,48.9 29.9,48.9 30.3,48.5 30.3,45.6 33.53,42.37 C16.2 40.74,49.18 R10.1 40.38,49.18 40.3,49.1 v40.3,49.2
PA10
  Top 0.2: IC1.69 30.99,46.99 31.72,47.72 32.91,47.72 34.46,49.26 34.46,50.86 | 34.46,50.86 34.46,50.98 | 34.46,50.86 35.27,51.67 J5.ID
PA11  (via drill 0.35)
  Top 0.2: IC1.70 30.49,47.48 v31.01,48 30.9,48 | v34.1,48 34.73,48.63 R8.1
  Bottom 0.2: v31.01,48 31.11,48.1 34,48.1 v34.1,48
PA12
  Top 0.2: R9.1 31.38,48.52 31.27,48.63 31.1,48.8 30.6,48.8 30.23,48.43 30.23,47.94 29.99,47.7 IC1.71
PA13  (via drill 0.35)
  Top 0.2: 29.39,46.04 IC1.72 29.5,47.6 29.6,47.7 v29.6,48.2 | v6.4,47.7 6.4,46.1 R20.2
  Bottom 0.2: v29.6,48.2 v6.4,47.7
PA14  (via drill 0.35)
  Top 0.2: IC1.76 23.54,44.34 23.4,44.2 v23.4,44.11 | v3.1,46.6 3.19,46.51 R18.2
  Bottom 0.2: v23.4,44.11 22.46,44.11 22.28,44.29 12.41,44.29 9.9,46.8 3.4,46.8 3.2,46.6 v3.1,46.6
PB3
  Top 0.2: R21.2 13,40.5 13,40.47 15.63,37.84 IC1.89
PB10  (via drill 0.35)
  Top 0.2: v44,41.5 42.66,42.84 IC1.47 | v54.2,20.2 55.38,19.02 57.08,19.02 58.27,20.21 U$6.CLK
  Bottom 0.2: v44,41.5 44,31.79 54.13,21.66 54.13,20.27 v54.2,20.2
PC0  (via drill 0.35)
  Top 0.2: IC1.15 34.99,32.31 v32.7,34.6 | v11.2,43.6 11.2,47.7 v17.2,53.7
  Bottom 0.2: R5.1 21.97,53.61 22.1,53.61 | 22.1,53.61 U1.4 | v32.7,34.6 17.3,34.6 11.65,40.25 11.5,40.4 11.2,40.7 v11.2,43.6 | v17.2,53.7 22.01,53.7 22.1,53.61
PC3  (via drill 0.35)
  Top 0.2: IC1.18 v36.49,29.11 v36.5,29.1 | v53.5,21.4 53.5,19.37 54.76,18.11 58.7,18.11 60.04,19.44 60.04,20.33 U$6.DOUT
  Bottom 0.2: v36.5,29.1 44,29.1 51.7,21.4 v53.5,21.4 53.6,21.4
PC9
  Top 0.2: U$2.GPIO0 19.86,43.38 21.22,44.74 32.49,44.74 IC1.66
PC10
  Top 0.2: IC1.78 21.52,43.34 U$2.RX
PC11
  Top 0.2: IC1.79 22.65,42.84 22.28,42.48 15.54,42.48 U$2.TX
PC12  (via drill 0.35)
  Top 0.2: IC1.80 23.84,42.34 v23.4,41.9
  Bottom 0.2: v23.4,41.9 18.9,41.9 17.85,42.95 17.6,43.2 17.42,43.38 U$2.GPIO2
PD5  (via drill 0.35)
  Top 0.2: v26,49.2 v26,46.6 | IC1.86 28.77,39.34 29.76,40.33 v29.76,42.54
  Bottom 0.2: U1.3 25.54,49.66 v26,49.2 | v26,46.6 26,44.4 25.6,44 D7.C 26.42,43.3 29.91,43.3 R6.2 30.67,42.54 v29.76,42.54
VBAT  (via drill 0.35)
  Top 0.2: C3.1 18.08,25.17 R16.2 22.47,25.17 v23.8,26.5 | v28.6,27.9 30.49,29.79 IC1.6
  Bottom 0.2: v23.8,26.5 25.2,27.9 v28.6,27.9
VDDA  (via drill 0.35)
  Top 0.2: R3.1 16.32,19.95 16.1,19.95 16.35,20.2 v21.1,20.2 | R3.1 | v38.8,32.4 38.49,32.09 IC1.22 38.49,28.69 v38.3,28.5 | R25.2 16.27,20.03 R3.1
  Bottom 0.2: v38.8,32.4 39,32.6 C2.2 41.66,31.3 C5.2 | v38.3,28.5 37.8,28 30.4,28 27.25,24.85 27.25,22.27 25.18,20.2 v21.1,20.2
VREF+  (via drill 0.35)
  Top 0.2: IC1.21 v37.99,32.49 v38,32.5 | v26.9,30.1 25.98,30.1 25.13,30.95 24.67,30.95 24.35,30.63 24.35,26.74 24.35,26.73 24.35,26.27 24.3,26.22 24.3,20.7 21.98,18.38 R3.2
  Bottom 0.2: v38,32.5 35.66,32.5 C1.1 C4.1 29.32,32.52 v26.9,30.1

### Text on the board
tNames: /home/milos/Downloads/vincent-clipart-20 (2).bmp